# EAGLE design prototype2 (EAGLE 9.3.1)

## Sheet 1 of 5
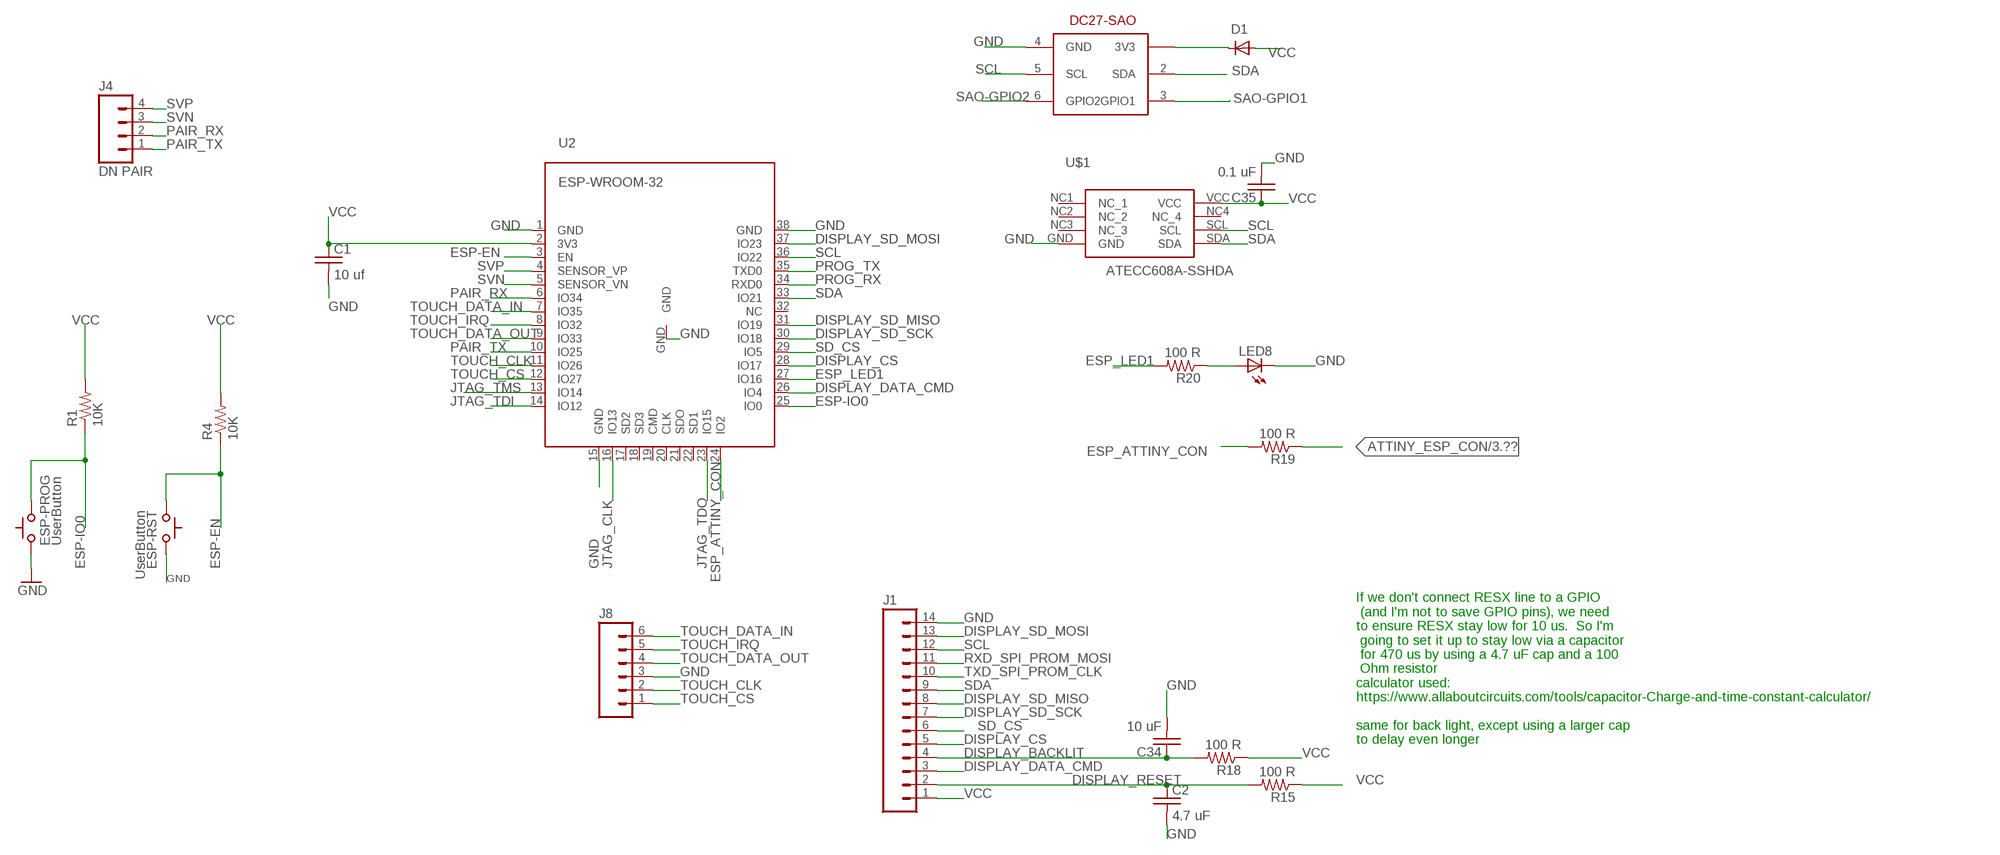
[diagram p0: schematic, sheet 1]

### Parts
C1  10 uf  C-USC0805  [C0805]
C2  4.7 uF  C-USC0805  [C0805]
C34  10 uF  C-USC0805  [C0805]
C35  0.1 uF  C-USC0805  [C0805]
D1  DIODESMA  [SMA-DIODE]
ESP-PROG  UserButton  SWITCH_TACTILETACTILE-2PIN-NARROW  [TACTILE-2PIN-NARROW]
ESP-RST  UserButton  SWITCH_TACTILETACTILE-2PIN-NARROW  [TACTILE-2PIN-NARROW]
J1  M14  [1X14]
J4  DN PAIR  M04PTH  [1X04]
J8  M06NO_SILK_YES_STOP  [1X06_NO_SILK_YES_STOP]
LED8  LED3MM  [LED3MM]
R1  10K  RESISTOR0805-RES  [0805]
R4  10K  RESISTOR0805-RES  [0805]
R15  100 R  RESISTOR0805-RES  [0805]
R18  100 R  RESISTOR0805-RES  [0805]
R19  100 R  RESISTOR0805-RES  [0805]
R20  100 R  RESISTOR0805-RES  [0805]
U2  ESP-WROOM-32  [ESP-WROOM-32]
U$1  ATECC608A-SSHDA  [8-SOIC]
U$4  DC-27-SAO  [3X2]

### Nets
ATTINY_ESP_CON: R19.1 ; also sheet 3
DISPLAY_BACKLIT: C34.1 J1.4 R18.2
DISPLAY_CS: J1.5 U2.28(IO17)
DISPLAY_DATA_CMD: J1.3 U2.26(IO4)
DISPLAY_RESET: C2.1 J1.2 R15.2
DISPLAY_SD_MISO: J1.8 U2.31(IO19)
DISPLAY_SD_MOSI: J1.13 U2.37(IO23)
DISPLAY_SD_SCK: J1.7 U2.30(IO18)
ESP-EN: ESP-RST.P$2(C) R4.1 U2.3(EN)
ESP-IO0: ESP-PROG.P$1(A) R1.1 U2.25(IO0)
ESP_ATTINY_CON: R19.2 U2.24(IO2)
ESP_LED1: R20.2 U2.27(IO16)
GND: C1.2 C2.2 C34.2 C35.2 ESP-PROG.P$2(C) ESP-RST.P$1(A) J1.14 J8.3 LED8.K(C) U2.1(GND) U2.15(GND) U2.38(GND) U2.GND U$1.GND U$4.4(GND) ; also sheet 2,3,4
JTAG_CLK: U2.16(IO13) ; also sheet 2
JTAG_TDI: U2.14(IO12) ; also sheet 2
JTAG_TDO: U2.23(IO15) ; also sheet 2
JTAG_TMS: U2.13(IO14) ; also sheet 2
N$1: D1.C U$4.1(3V3)
N$9: LED8.A R20.1
PAIR_RX: J4.2 U2.6(IO34)
PAIR_TX: J4.1 U2.10(IO25)
PROG_RX: U2.34(RXD0) ; also sheet 2
PROG_TX: U2.35(TXD0) ; also sheet 2
RXD_SPI_PROM_MOSI: J1.11 ; also sheet 2
SAO-GPIO1: U$4.3(GPIO1)
SAO-GPIO2: U$4.6(GPIO2)
SCL: J1.12 U2.36(IO22) U$1.SCL U$4.5(SCL)
SD_CS: J1.6 U2.29(IO5)
SDA: J1.9 U2.33(IO21) U$1.SDA U$4.2(SDA)
SVN: J4.3 U2.5(SENSOR_VN)
SVP: J4.4 U2.4(SENSOR_VP)
TOUCH_CLK: J8.2 U2.11(IO26)
TOUCH_CS: J8.1 U2.12(IO27)
TOUCH_DATA_IN: J8.6 U2.7(IO35)
TOUCH_DATA_OUT: J8.4 U2.9(IO33)
TOUCH_IRQ: J8.5 U2.8(IO32)
TXD_SPI_PROM_CLK: J1.10 ; also sheet 2
VCC: C1.1 C35.1 D1.A J1.1 R1.2 R4.2 R15.1 R18.1 U2.2(3V3) U$1.VCC ; also sheet 2,4
Unconnected: U2.17(SD2) U2.18(SD3) U2.19(CMD) U2.20(CLK) U2.21(SDO) U2.22(SD1) U2.32(NC) U$1.NC1(NC_1) U$1.NC2(NC_2) U$1.NC3(NC_3) U$1.NC4(NC_4)

### Notes on the sheet
- If we don't connect RESX line to a GPIO
   (and I'm not to save GPIO pins), we need 
  to ensure RESX stay low for 10 us.  So I'm
   going to set it up to stay low via a capacitor
   for 470 us by using a 4.7 uF cap and a 100
   Ohm resistor
  calculator used:
  https://www.allaboutcircuits.com/tools/capacitor-Charge-and-time-constant-calculator/
  
  same for back light, except using a larger cap 
  to delay even longer

## Sheet 2 of 5
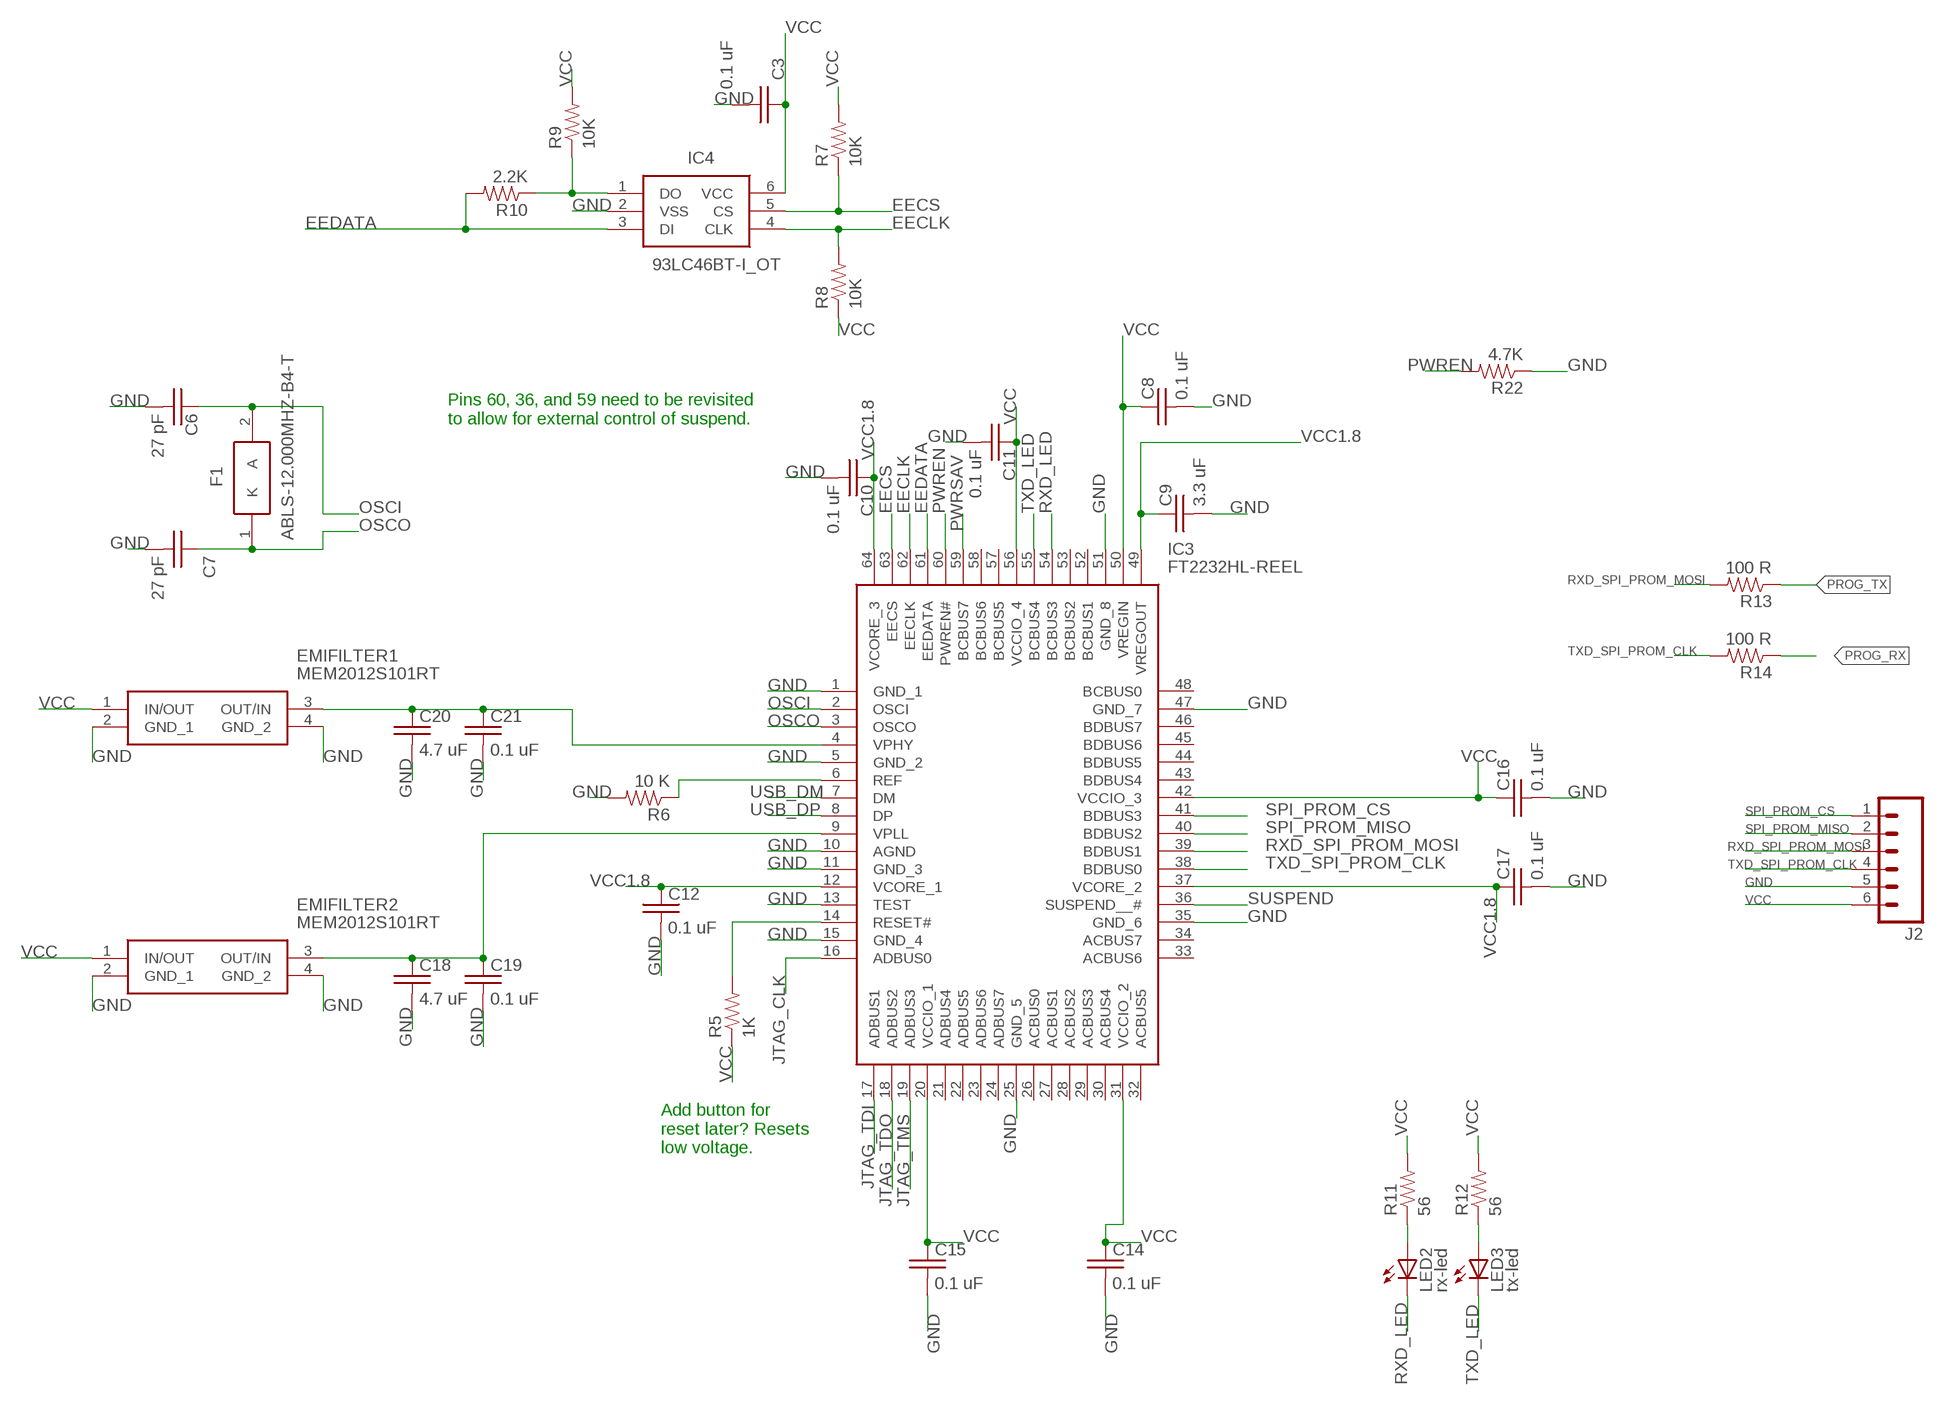
[diagram p1: schematic, sheet 2]

### Parts
C3  0.1 uF  C-USC0805  [C0805]
C6  27 pF  C-USC0805  [C0805]
C7  27 pF  C-USC0805  [C0805]
C8  0.1 uF  C-USC0805  [C0805]
C9  3.3 uF  C-USC0805  [C0805]
C10  0.1 uF  C-USC0805  [C0805]
C11  0.1 uF  C-USC0805  [C0805]
C12  0.1 uF  C-USC0805  [C0805]
C14  0.1 uF  C-USC0805  [C0805]
C15  0.1 uF  C-USC0805  [C0805]
C16  0.1 uF  C-USC0805  [C0805]
C17  0.1 uF  C-USC0805  [C0805]
C18  4.7 uF  C-USC0805  [C0805]
C19  0.1 uF  C-USC0805  [C0805]
C20  4.7 uF  C-USC0805  [C0805]
C21  0.1 uF  C-USC0805  [C0805]
EMIFILTER1  MEM2012S101RT  [MEM2012S101RT]
EMIFILTER2  MEM2012S101RT  [MEM2012S101RT]
F1  ABLS-12.000MHZ-B4-T  [HC/49US-(AT49)_1]
IC3  FT2232HL-REEL  [QFP50P1200X1200X160-64N]
IC4  93LC46BT-I_OT  [SOT95P270X145-6N]
J2  M06SILK_FEMALE_PTH  [1X06]
LED2  rx-led  LED3MM  [LED3MM]
LED3  tx-led  LED3MM  [LED3MM]
R5  1K  RESISTOR0805-RES  [0805]
R6  10 K  RESISTOR0805-RES  [0805]
R7  10K  RESISTOR0805-RES  [0805]
R8  10K  RESISTOR0805-RES  [0805]
R9  10K  RESISTOR0805-RES  [0805]
R10  2.2K  RESISTOR0805-RES  [0805]
R11  56  RESISTOR0805-RES  [0805]
R12  56  RESISTOR0805-RES  [0805]
R13  100 R  RESISTOR0805-RES  [0805]
R14  100 R  RESISTOR0805-RES  [0805]
R22  4.7K  RESISTOR0805-RES  [0805]

### Nets
EECLK: IC3.62(EECLK) IC4.4(CLK) R8.2
EECS: IC3.63(EECS) IC4.5(CS) R7.1
EEDATA: IC3.61(EEDATA) IC4.3(DI) R10.2
GND: C3.2 C6.2 C7.2 C8.2 C9.2 C10.2 C11.2 C12.2 C14.2 C15.2 C16.2 C17.2 C18.2 C19.2 C20.2 C21.2 EMIFILTER1.2(GND_1) EMIFILTER1.4(GND_2) EMIFILTER2.2(GND_1) EMIFILTER2.4(GND_2) IC3.1(GND_1) IC3.5(GND_2) IC3.10(AGND) IC3.11(GND_3) IC3.13(TEST) IC3.15(GND_4) IC3.25(GND_5) IC3.35(GND_6) IC3.47(GND_7) IC3.51(GND_8) IC4.2(VSS) J2.5 R6.2 R22.1 ; also sheet 1,3,4
JTAG_CLK: IC3.16(ADBUS0) ; also sheet 1
JTAG_TDI: IC3.17(ADBUS1) ; also sheet 1
JTAG_TDO: IC3.18(ADBUS2) ; also sheet 1
JTAG_TMS: IC3.19(ADBUS3) ; also sheet 1
N$6: IC3.14(RESET#) R5.2
N$7: IC3.6(REF) R6.1
N$8: IC4.1(DO) R9.1 R10.1
N$11: LED2.A R11.1
N$13: LED3.A R12.1
N$18: C18.1 C19.1 EMIFILTER2.3(OUT/IN) IC3.9(VPLL)
N$19: C20.1 C21.1 EMIFILTER1.3(OUT/IN) IC3.4(VPHY)
OSCI: C6.1 F1.2(A) IC3.2(OSCI)
OSCO: C7.1 F1.1(K) IC3.3(OSCO)
PROG_RX: R14.1 ; also sheet 1
PROG_TX: R13.1 ; also sheet 1
PWREN: IC3.60(PWREN#) R22.2
PWRSAV: IC3.59(BCBUS7)
RXD_LED: IC3.54(BCBUS3) LED2.K(C)
RXD_SPI_PROM_MOSI: IC3.39(BDBUS1) J2.3 R13.2 ; also sheet 1
SPI_PROM_CS: IC3.41(BDBUS3) J2.1
SPI_PROM_MISO: IC3.40(BDBUS2) J2.2
SUSPEND: IC3.36(SUSPEND__#)
TXD_LED: IC3.55(BCBUS4) LED3.K(C)
TXD_SPI_PROM_CLK: IC3.38(BDBUS0) J2.4 R14.2 ; also sheet 1
USB_DM: IC3.7(DM) ; also sheet 4
USB_DP: IC3.8(DP) ; also sheet 4
VCC: C3.1 C8.1 C11.1 C14.1 C15.1 C16.1 EMIFILTER1.1(IN/OUT) EMIFILTER2.1(IN/OUT) IC3.20(VCCIO_1) IC3.31(VCCIO_2) IC3.42(VCCIO_3) IC3.50(VREGIN) IC3.56(VCCIO_4) IC4.6(VCC) J2.6 R5.1 R7.2 R8.1 R9.2 R11.2 R12.2 ; also sheet 1,4
VCC1.8: C9.1 C10.1 C12.1 C17.1 IC3.12(VCORE_1) IC3.37(VCORE_2) IC3.49(VREGOUT) IC3.64(VCORE_3)
Unconnected: IC3.21(ADBUS4) IC3.22(ADBUS5) IC3.23(ADBUS6) IC3.24(ADBUS7) IC3.26(ACBUS0) IC3.27(ACBUS1) IC3.28(ACBUS2) IC3.29(ACBUS3) IC3.30(ACBUS4) IC3.32(ACBUS5) IC3.33(ACBUS6) IC3.34(ACBUS7) IC3.43(BDBUS4) IC3.44(BDBUS5) IC3.45(BDBUS6) IC3.46(BDBUS7) IC3.48(BCBUS0) IC3.52(BCBUS1) IC3.53(BCBUS2) IC3.57(BCBUS5) IC3.58(BCBUS6)

### Notes on the sheet
- Pins 60, 36, and 59 need to be revisited 
  to allow for external control of suspend.
- Add button for 
  reset later? Resets
  low voltage.

## Sheet 3 of 5
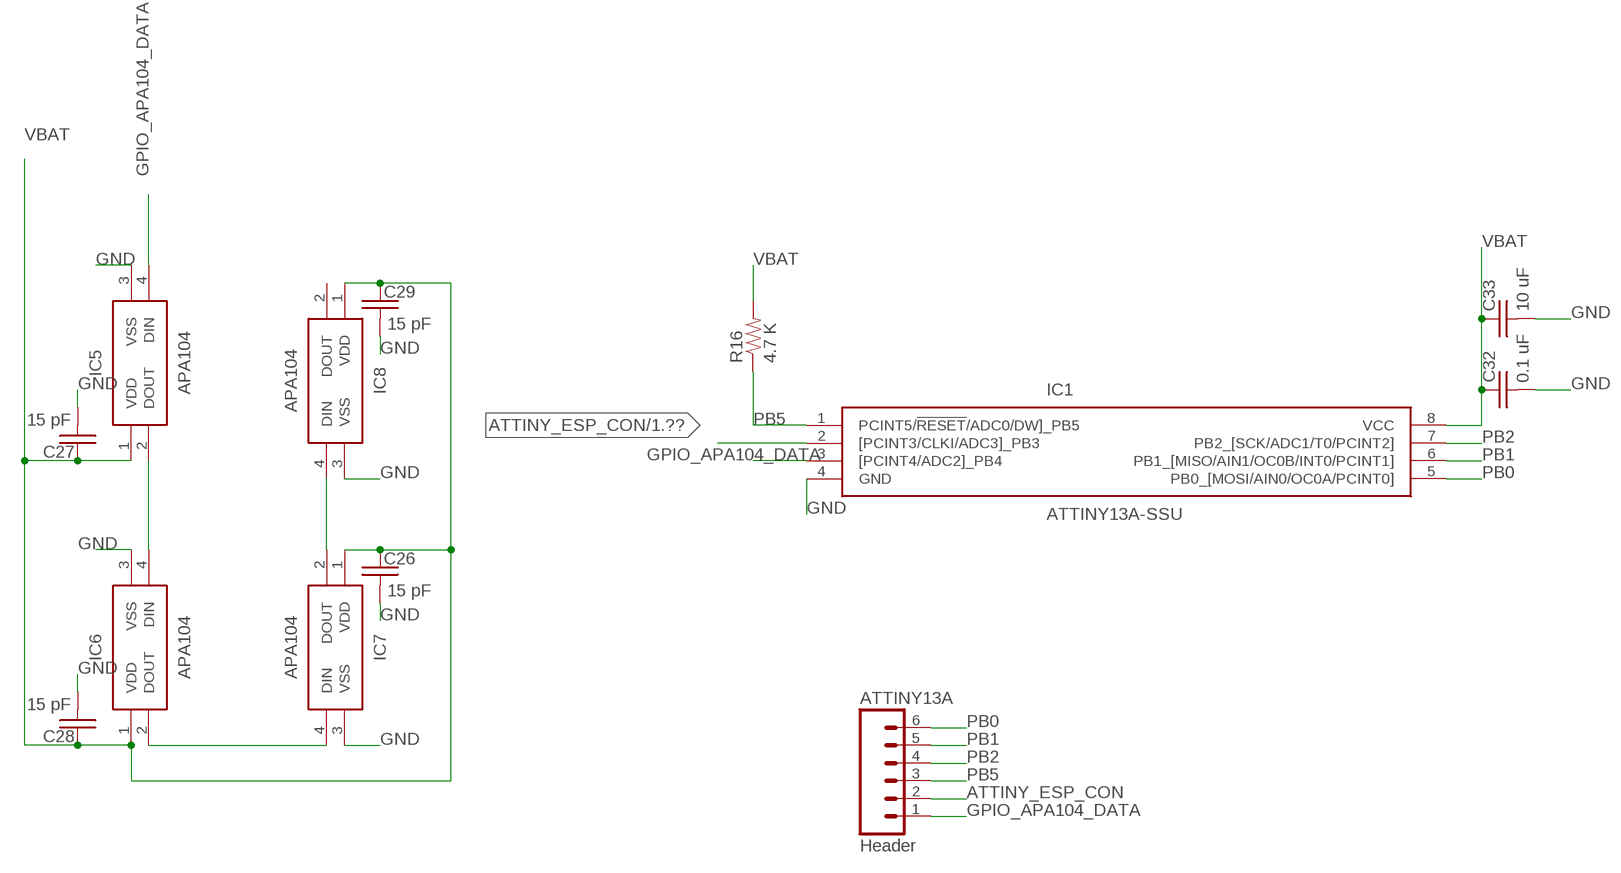
[diagram p2: schematic, sheet 3]

### Parts
ATTINY13A  Header  M06SILK_FEMALE_PTH  [1X06]
C26  15 pF  C-USC0805  [C0805]
C27  15 pF  C-USC0805  [C0805]
C28  15 pF  C-USC0805  [C0805]
C29  15 pF  C-USC0805  [C0805]
C32  0.1 uF  C-USC0805  [C0805]
C33  10 uF  C-USC0805  [C0805]
IC1  ATTINY13A-SSU  [SOIC127P600X175-8N]
IC5  APA104  [APA104]
IC6  APA104  [APA104]
IC7  APA104  [APA104]
IC8  APA104  [APA104]
R16  4.7 K  RESISTOR0805-RES  [0805]

### Nets
ATTINY_ESP_CON: ATTINY13A.2 IC1.2([PCINT3/CLKI/ADC3]_PB3) ; also sheet 1
GND: C26.2 C27.2 C28.2 C29.2 C32.2 C33.2 IC1.4(GND) IC5.3(VSS) IC6.3(VSS) IC7.3(VSS) IC8.3(VSS) ; also sheet 1,2,4
GPIO_APA104_DATA: ATTINY13A.1 IC1.3([PCINT4/ADC2]_PB4) IC5.4(DIN)
N$4: IC5.2(DOUT) IC6.4(DIN)
N$12: IC6.2(DOUT) IC7.4(DIN)
N$22: IC7.2(DOUT) IC8.4(DIN)
PB0: ATTINY13A.6 IC1.5(PB0_[MOSI/AIN0/OC0A/PCINT0])
PB1: ATTINY13A.5 IC1.6(PB1_[MISO/AIN1/OC0B/INT0/PCINT1])
PB2: ATTINY13A.4 IC1.7(PB2_[SCK/ADC1/T0/PCINT2])
PB5: ATTINY13A.3 IC1.1(PCINT5/!RESET!/ADC0/DW]_PB5) R16.1
VBAT [5v]: C26.1 C27.1 C28.1 C29.1 C32.1 C33.1 IC1.8(VCC) IC5.1(VDD) IC6.1(VDD) IC7.1(VDD) IC8.1(VDD) R16.2 ; also sheet 4
Unconnected: IC8.2(DOUT)

## Sheet 4 of 5
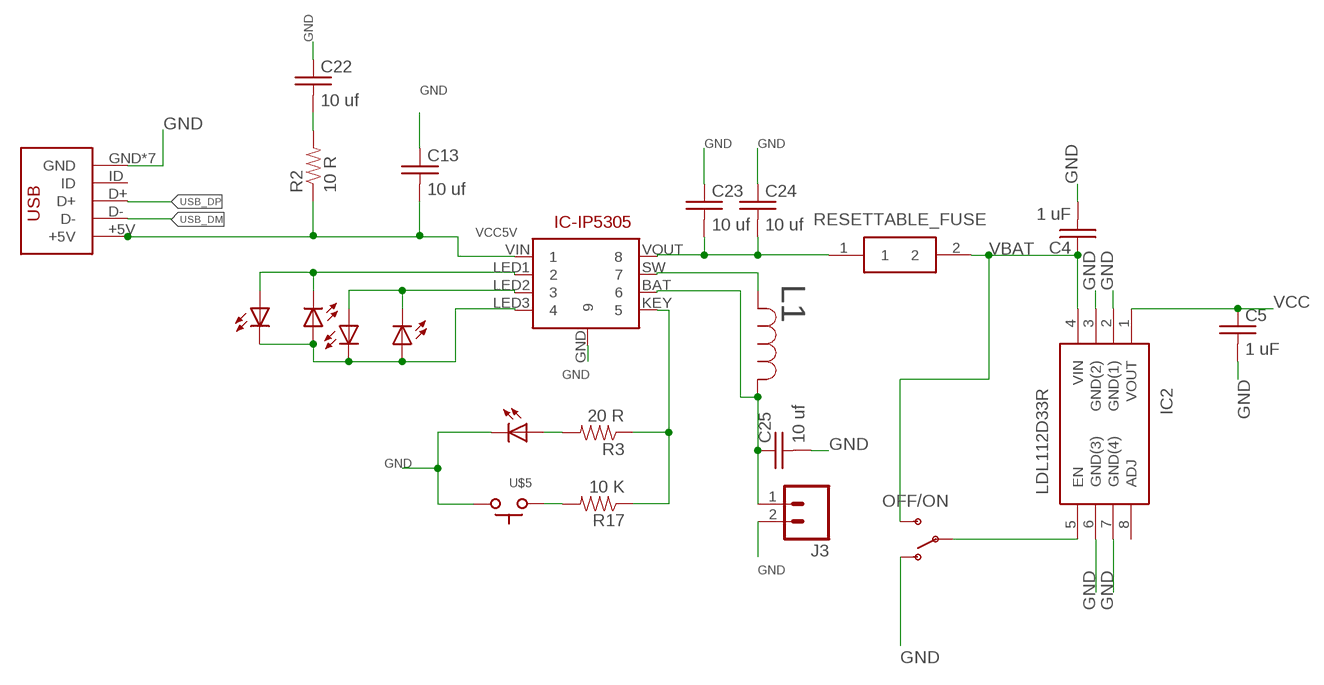
[diagram p3: schematic, sheet 4]

### Parts
C4  1 uF  C-USC0805  [C0805]
C5  1 uF  C-USC0805  [C0805]
C13  10 uf  C-USC0805  [C0805]
C22  10 uf  C-USC0805  [C0805]
C23  10 uf  C-USC0805  [C0805]
C24  10 uf  C-USC0805  [C0805]
C25  10 uf  C-USC0805  [C0805]
IC2  LDL112D33R  [SOIC127P600X175-8N]
IC-IP5305  IP5305ESOP8  [SOIC127P600X165-8]
J3  M02PTH  [1X02]
L1  NRS4018T2R2MDGJ  [IND_TAIYO_NRS4018]
LED1  LED3MM  [LED3MM]
LED4  LED3MM  [LED3MM]
LED5  LED3MM  [LED3MM]
LED6  LED3MM  [LED3MM]
LED7  LED3MM  [LED3MM]
OFF/ON  SWITCH-SPSTPTH  [SWITCH-SPDT]
R2  10 R  RESISTOR0805-RES  [0805]
R3  20 R  RESISTOR0805-RES  [0805]
R17  10 K  RESISTOR0805-RES  [0805]
RESETTABLE_FUSE  0ZCJ0050FF2G  [FUSC3216X55N]
U$2  DX4R005JJ2DX4R005JJ2  [DX4R005JJ2]
U$5  SWITCH_TACTILETACTILE-2PIN-NARROW  [TACTILE-2PIN-NARROW]

### Nets
GND: C4.2 C5.2 C13.1 C22.1 C23.1 C24.1 C25.2 IC2.2(GND(1)) IC2.3(GND(2)) IC2.6(GND(3)) IC2.7(GND(4)) IC-IP5305.GND J3.2 LED7.K(C) OFF/ON.1(O) U$2.GND U$2.P$6(GND) U$2.P$7(GND) U$2.P$8(GND) U$2.P$9(GND) U$2.P$10(GND) U$2.P$11(GND) U$5.P$1(A) ; also sheet 1,2,3
N$2: IC2.5(EN) OFF/ON.2(P)
N$5: IC-IP5305.LED1 LED1.A LED4.K(C)
N$10: C23.2 C24.2 IC-IP5305.VOUT RESETTABLE_FUSE.1
N$14: IC-IP5305.LED2 LED5.A LED6.K(C)
N$15: IC-IP5305.LED3 LED1.K(C) LED4.A LED5.K(C) LED6.A
N$16: C22.2 R2.2
N$17: IC-IP5305.SW L1.2
N$20: C25.1 IC-IP5305.BAT J3.1 L1.1
N$21: IC-IP5305.KEY R3.1 R17.1
N$24: LED7.A R3.2
N$25: R17.2 U$5.P$2(C)
USB_DM: U$2.D- ; also sheet 2
USB_DP: U$2.D+ ; also sheet 2
VBAT [5v]: C4.1 IC2.4(VIN) OFF/ON.3(S) RESETTABLE_FUSE.2 ; also sheet 3
VCC: C5.1 IC2.1(VOUT) ; also sheet 1,2
VCC5V [5v]: C13.2 IC-IP5305.VIN R2.1 U$2.+5V
Unconnected: IC2.8(ADJ) U$2.ID

## Sheet 5 of 5
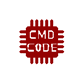
[diagram p4: schematic, sheet 5]

### Parts
U$3  CMD_C0DE_LOGOCMD_CODE_LOGO_TOP_COPPER  [CMD_C0DE_LOGO_TOP_COPPER]

## Library data of the parts
ATTINY13A J2 = connector:M06: Header 6 Standard 6-pin 0.1" header. Use with straight break away headers (SKU : PRT-00116), right angle break away headers (PRT-00553), swiss pins (PRT-00743), machine pins (PRT-00117), and female headers (PRT-00115). Molex polarized connector foot print use with SKU : PRT-08094 with associated crimp pins and housings. NOTES ON THE VARIANTS LOCK and LOCK_LONGPADS... This footprint was designed to help hold the alignment of a through-hole component (i.e. 6-pin header) while soldering it into place. You may notice that each hole has been shifted either up or down by 0.005 of an inch from it's more standard position (which is a perfectly straight line). This slight alteration caused the pins (the squares in the middle) to touch the edges of the holes. Because they are alternating, it causes a "brace" to hold the component in place. 0.005 has proven to be the perfect amount of "off-center" position when using our standard breakaway headers. Although looks a little odd when you look at the bare footprint, once you have a header in there, the alteration is very hard to notice. Also,if you push a header all the way into place, it is covered up entirely on the bottom side. This idea of altering the position of holes to aid alignment will be further integrated into the Sparkfun Library for other footprints. It can help hold any component with 3 or more connection pins.; PROD_ID: CONN-08437
C1-C29 C32-C35 = passives:C-US: CAPACITOR, American symbol
D1 = passives:DIODE: Diode These are standard reverse protection diodes and small signal diodes. SMA package can handle up to about 1A. SOD-323 can handle about 200mA. What the SOD-323 package when ordering, there are some mfgs out there that are 5-pin packages.
EMIFILTER1 EMIFILTER2 = passives:MEM2012S101RT: EMI Filter Circuits Source: Datasheet <https://componentsearchengine.com/Datasheets/1/MEM2012S101RT.pdf>; DESCRIPTION: EMI Filter Circuits; HEIGHT: 1mm; MANUFACTURER_NAME: TDK; MANUFACTURER_PART_NUMBER: MEM2012S101RT; MOUSER_PART_NUMBER: N/A
ESP-PROG ESP-RST = dc-26:SWITCH_TACTILE
F1 = crystals-timing:ABLS-12.000MHZ-B4-T: ABRACON - ABLS-12.000MHZ-B4-T - CRYSTAL, 12MHZ, 18PF, HC-49US Source: Datasheet <https://componentsearchengine.com/Datasheets/2/ABLS-12.000MHZ-B4-T.pdf>; DESCRIPTION: ABRACON - ABLS-12.000MHZ-B4-T - CRYSTAL, 12MHZ, 18PF, HC-49US; HEIGHT: mm; MANUFACTURER_NAME: ABRACON; MANUFACTURER_PART_NUMBER: ABLS-12.000MHZ-B4-T; MOUSER_PART_NUMBER: 815-ABLS-12.0M-T; MOUSER_PRICE-STOCK: https://www.mouser.com/Search/Refine.aspx?Keyword=815-ABLS-12.0M-T; RS_PART_NUMBER: 1710207; RS_PRICE-STOCK: http://uk.rs-online.com/web/p/products/1710207
IC1 = ICs:ATTINY13A-SSU: ATTINY13A-SSU, 8 bit AVR Microcontroller 20MHz 1, 64kB, B Flash, 64B RAM, SPI 8-Pin SOIC Source: Datasheet <http://www.mouser.com/datasheet/2/268/doc8126-1315482.pdf>; DESCRIPTION: ATTINY13A-SSU, 8 bit AVR Microcontroller 20MHz 1, 64kB, B Flash, 64B RAM, SPI 8-Pin SOIC; HEIGHT: 1.75mm; MANUFACTURER_NAME: Microchip; MANUFACTURER_PART_NUMBER: ATTINY13A-SSU; MOUSER_PART_NUMBER: 556-ATTINY13A-SSU
IC2 = voltage-regulator:LDL112D33R: LDO Voltage Regulators 1.2 A low quiescent current LDO with reverse current protection Source: Datasheet <https://www.arrow.com/en/products/ldl112d33r/stmicroelectronics>; ARROW_PART_NUMBER: LDL112D33R; ARROW_PRICE/STOCK: https://www.arrow.com/en/products/ldl112d33r/stmicroelectronics; DESCRIPTION: LDO Voltage Regulators 1.2 A low quiescent current LDO with reverse current protection; HEIGHT: 1.75mm; MANUFACTURER_NAME: STMicroelectronics; MANUFACTURER_PART_NUMBER: LDL112D33R
IC3 = ICs:FT2232HL-REEL: FTDI Chip FT2232HL-REEL, USB Controller, 4-channel, 480MBps, USB 2.0, 64-Pin LQFP Source: Datasheet <https://componentsearchengine.com/Datasheets/1/FT2232HL-REEL.pdf>; DESCRIPTION: FTDI Chip FT2232HL-REEL, USB Controller, 4-channel, 480MBps, USB 2.0, 64-Pin LQFP; HEIGHT: 1.6mm; MANUFACTURER_NAME: FTDI Chip; MANUFACTURER_PART_NUMBER: FT2232HL-REEL; MOUSER_PART_NUMBER: 895-FT2232HL
IC4 = eeprom:93LC46BT-I_OT: 1K,64 X 16 Serial EE,SOT23 Source: Datasheet <https://componentsearchengine.com/Datasheets/1/93LC46BT-I_OT.pdf>; DESCRIPTION: 1K,64 X 16 Serial EE,SOT23; HEIGHT: 1.45mm; MANUFACTURER_NAME: Microchip; MANUFACTURER_PART_NUMBER: 93LC46BT-I/OT; MOUSER_PART_NUMBER: 579-93LC46BT-I/OT
IC5-IC8 = leds:APA104: APA104 LED CHIP Source: Datasheet <http://www.ledlightinghut.com/files/APA104%20Datasheet.pdf>; DESCRIPTION: APA104 LED Chip; HEIGHT: mm; MANUFACTURER_NAME: Worldsemi; MANUFACTURER_PART_NUMBER: APA104; SUPPLIER_NAME: RS
IC-IP5305 = charging-ic:IP5305: IP5305
J1 = connector:M14: Header 14 Standard 14-pin 0.1" header. Use with straight break away headers (SKU : PRT-00116), right angle break away headers (PRT-00553), swiss pins (PRT-00743), machine pins (PRT-00117), and female headers (PRT-00115).
J3 = connector:M02: Standard 2-pin 0.1" header. Use with - straight break away headers ( PRT-00116) - right angle break away headers (PRT-00553) - swiss pins (PRT-00743) - machine pins (PRT-00117) - female headers (PRT-00115) Molex polarized connector foot print use with: PRT-08233 with associated crimp pins and housings. 2.54_SCREWTERM for use with PRT-10571. 3.5mm Screw Terminal footprints for PRT-08084 5mm Screw Terminal footprints for use with PRT-08432
J4 = connector:M04: Header 4 Standard 4-pin 0.1" header. Use with straight break away headers (SKU : PRT-00116), right angle break away headers (PRT-00553), swiss pins (PRT-00743), machine pins (PRT-00117), and female headers (PRT-00115). Molex polarized connector foot print use with SKU : PRT-08231 with associated crimp pins and housings. 1MM SMD Version SKU: PRT-10208; PROD_ID: CONN-09696
J8 = connector:M06: Header 6 Standard 6-pin 0.1" header. Use with straight break away headers (SKU : PRT-00116), right angle break away headers (PRT-00553), swiss pins (PRT-00743), machine pins (PRT-00117), and female headers (PRT-00115). Molex polarized connector foot print use with SKU : PRT-08094 with associated crimp pins and housings. NOTES ON THE VARIANTS LOCK and LOCK_LONGPADS... This footprint was designed to help hold the alignment of a through-hole component (i.e. 6-pin header) while soldering it into place. You may notice that each hole has been shifted either up or down by 0.005 of an inch from it's more standard position (which is a perfectly straight line). This slight alteration caused the pins (the squares in the middle) to touch the edges of the holes. Because they are alternating, it causes a "brace" to hold the component in place. 0.005 has proven to be the perfect amount of "off-center" position when using our standard breakaway headers. Although looks a little odd when you look at the bare footprint, once you have a header in there, the alteration is very hard to notice. Also,if you push a header all the way into place, it is covered up entirely on the bottom side. This idea of altering the position of holes to aid alignment will be further integrated into the Sparkfun Library for other footprints. It can help hold any component with 3 or more connection pins.
L1 = passives:NRS4018T2R2MDGJ: Inductor: CD43; MANUFACTURER_PART_NUMBER: NRS4018T2R2MDGJ; VENDOR: TAIYO YUDEN
LED1-LED8 = leds:LED: LEDs Standard schematic elements and footprints for 5mm, 3mm, 1206, and 0603 sized LEDs. 5mm - Spark Fun Electronics SKU : COM-00529 (and others)
OFF/ON = switches:SWITCH-SPST: SPST Switch Simple slide switch.
R1 R4 R15 R18-R20 = dc-26:RESISTOR: Resistor Basic schematic elements and footprints for 0603, 1206, and PTH resistors.
R2 R3 R5-R14 R16 R17 R22 = passives:RESISTOR: Resistor Basic schematic elements and footprints for 0603, 1206, and PTH resistors.
RESETTABLE_FUSE = passives:0ZCJ0050FF2G: Resettable Fuses - PPTC <https://componentsearchengine.com/Images/9/0ZCJ0050FF2G.jpg> Source: Datasheet <https://www.belfuse.com/resources/CircuitProtection/datasheets/0ZCJ Nov2016.pdf>; DESCRIPTION: Resettable Fuses - PPTC; HEIGHT: 0.55mm; MANUFACTURER_NAME: Bel-Stewart; MANUFACTURER_PART_NUMBER: 0ZCJ0050FF2G; SUPPLIER_NAME: RS
U2 = ICs:ESP-WROOM-32
U$1 = ICs:ATECC608A-SSHDA
U$2 = connector:DX4R005JJ2
U$3 = logos:CMD_C0DE_LOGO
U$4 = defcon:DC-27-SAO: DC27SAO device
U$5 = switches:SWITCH_TACTILE

## Net classes
0 default: width 0.178 mm, drill 0.8 mm, clearance 0.178 mm
1 min: width 0.152 mm, drill 0.8 mm, clearance 0.152 mm
2 5v: width 0.254 mm, drill 0.8 mm, clearance 0.178 mm

## Board
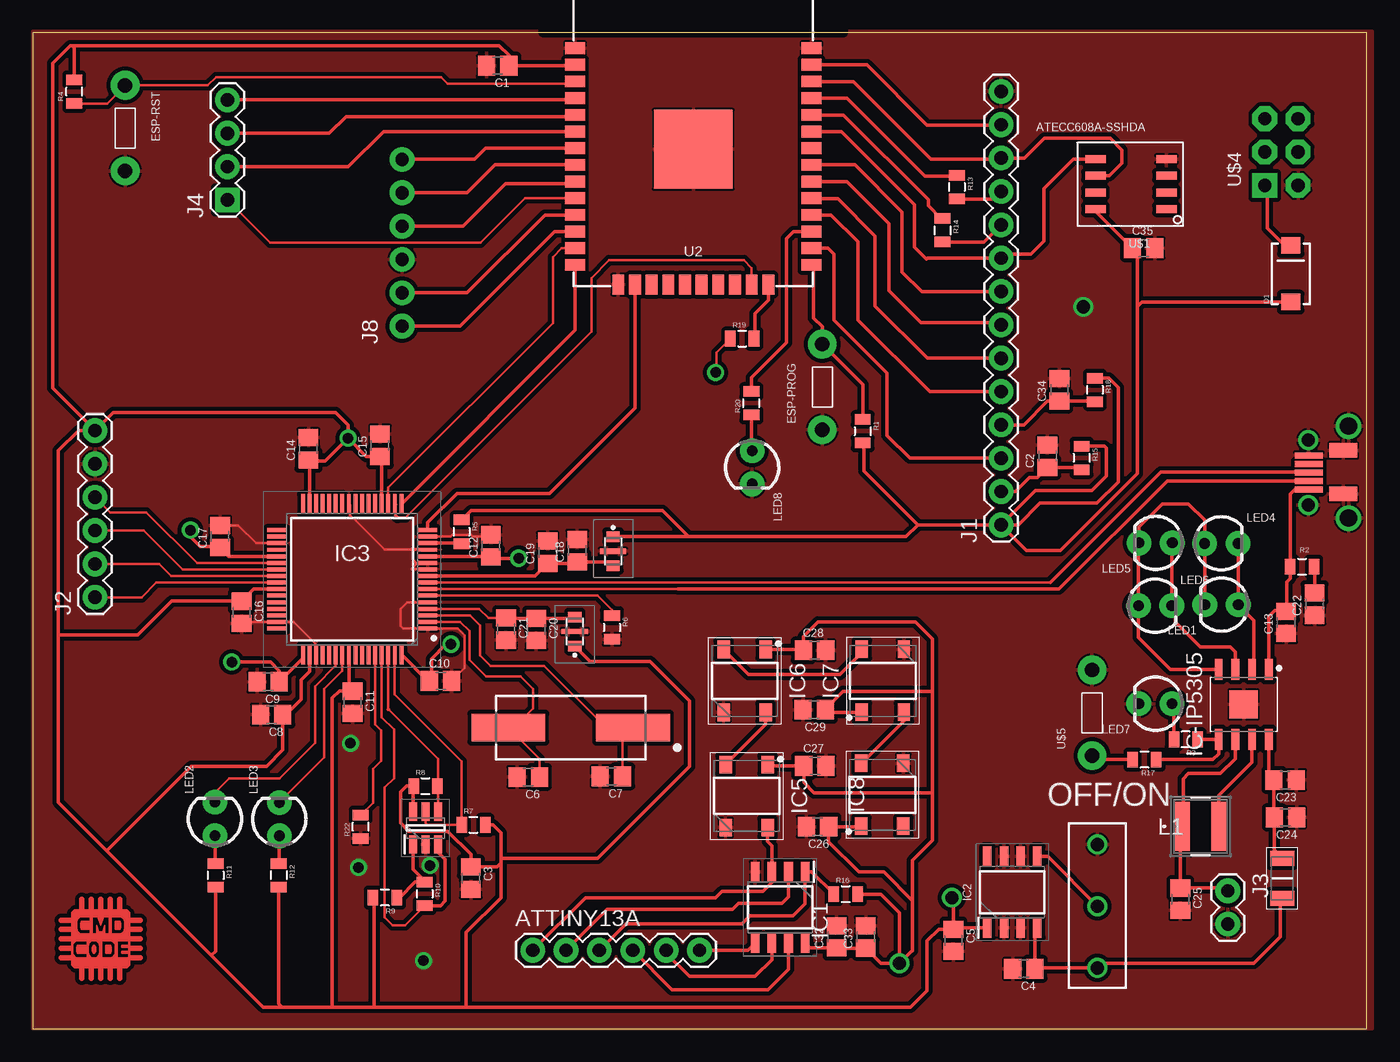
[diagram p5: board, top side]
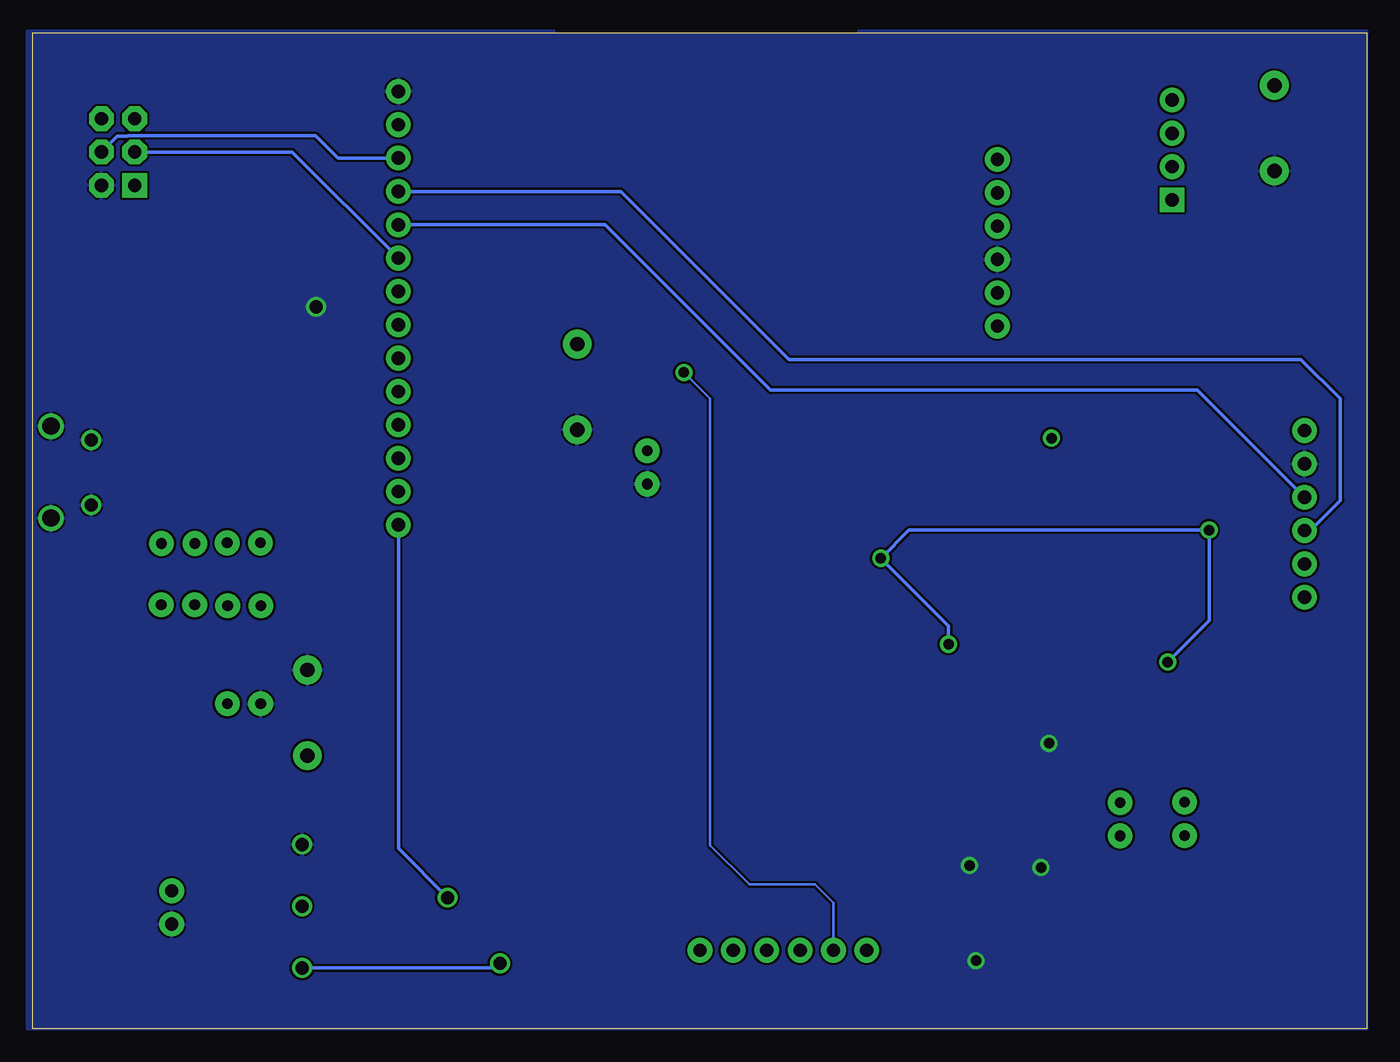
[diagram p6: board, bottom side, seen from below]

Size 101.58 x 75.87 mm. Coordinates in mm from the lower left corner, seen from the top.
Outline: 0,0 101.58,0 101.58,75.87 0,75.87 0,0
Copper layers (1*16): Top 0.035mm / dielectric 1.5mm / Bottom 0.035mm
Design rules "OthermillDRC_30_deg_v2": minimum track width 6mil, minimum drill 0.8mm, track to track 6mil, track to pad 6mil, pad to pad 6mil, via to via 6mil, smd to smd 0mil, copper to edge 0mil, drill to drill 6mil, minimum pad ring 10mil, minimum via ring 10mil, stop-mask expansion 1mil, vias tented up to drill 30mil, thermal gap 6mil

### Footprints (pad centres in the part's own frame; a part is rotated, then mirrored left to right if it is on the bottom)
1X06 = drill 1.016 pad 1.88: 1 0,0; 2 2.54,0; 3 5.08,0; 4 7.62,0; 5 10.16,0; 6 12.7,0
C0805 = smd 1.3 x 1.5: 1 -0.85,0; 2 0.85,0
SMA-DIODE = smd 1.27 x 1.47: A -2.15,0; C 2.15,0
MEM2012S101RT = smd 0.8 x 1: 1 -1.1,0; 3 1.1,0 | smd 0.4 x 1: 2 0,-0.5; 4 0,0.5
TACTILE-2PIN-NARROW = drill 1.1 pad 2.184: P$1 3.264,0; P$2 -3.264,0
HC/49US-(AT49)_1 = smd 5.6 x 2.1: 1 -4.75,0; 2 4.75,0
SOIC127P600X175-8N = smd 1.525 x 0.65: 1 -2.712,1.905; 2 -2.712,0.635; 3 -2.712,-0.635; 4 -2.712,-1.905; 5 2.712,-1.905; 6 2.712,-0.635; 7 2.712,0.635; 8 2.712,1.905
QFP50P1200X1200X160-64N = smd 1.475 x 0.3: 1 -5.738,3.75; 2 -5.738,3.25; 3 -5.738,2.75; 4 -5.738,2.25; 5 -5.738,1.75; 6 -5.738,1.25; 7 -5.738,0.75; 8 -5.738,0.25; 9 -5.738,-0.25; 10 -5.738,-0.75; 11 -5.738,-1.25; 12 -5.738,-1.75; 13 -5.738,-2.25; 14 -5.738,-2.75; 15 -5.738,-3.25; 16 -5.738,-3.75; 33 5.738,-3.75; 34 5.738,-3.25; 35 5.738,-2.75; 36 5.738,-2.25; 37 5.738,-1.75; 38 5.738,-1.25; 39 5.738,-0.75; 40 5.738,-0.25; 41 5.738,0.25; 42 5.738,0.75; 43 5.738,1.25; 44 5.738,1.75; 45 5.738,2.25; 46 5.738,2.75; 47 5.738,3.25; 48 5.738,3.75 | smd 0.3 x 1.475: 17 -3.75,-5.738; 18 -3.25,-5.738; 19 -2.75,-5.738; 20 -2.25,-5.738; 21 -1.75,-5.738; 22 -1.25,-5.738; 23 -0.75,-5.738; 24 -0.25,-5.738; 25 0.25,-5.738; 26 0.75,-5.738; 27 1.25,-5.738; 28 1.75,-5.738; 29 2.25,-5.738; 30 2.75,-5.738; 31 3.25,-5.738; 32 3.75,-5.738; 49 3.75,5.738; 50 3.25,5.738; 51 2.75,5.738; 52 2.25,5.738; 53 1.75,5.738; 54 1.25,5.738; 55 0.75,5.738; 56 0.25,5.738; 57 -0.25,5.738; 58 -0.75,5.738; 59 -1.25,5.738; 60 -1.75,5.738; 61 -2.25,5.738; 62 -2.75,5.738; 63 -3.25,5.738; 64 -3.75,5.738
SOT95P270X145-6N = smd 1.4 x 0.6: 1 -1.25,0.95; 2 -1.25,0; 3 -1.25,-0.95; 4 1.25,-0.95; 5 1.25,0; 6 1.25,0.95
APA104 = smd 1.35 x 0.95: 1 -2.4,1.6; 2 -2.4,-1.6; 3 2.4,-1.6; 4 2.4,1.6
SOIC127P600X165-8 = smd 1.609 x 0.594: BAT 2.653,-0.635; KEY 2.653,-1.905; LED1 -2.653,0.635; LED2 -2.653,-0.635; LED3 -2.653,-1.905; SW 2.653,0.635; VIN -2.653,1.905; VOUT 2.653,1.905 | smd 2.15 x 2.15: GND 0,0
1X14 = drill 1.016 pad 1.88: 1 0,0; 2 2.54,0; 3 5.08,0; 4 7.62,0; 5 10.16,0; 6 12.7,0; 7 15.24,0; 8 17.78,0; 9 20.32,0; 10 22.86,0; 11 25.4,0; 12 27.94,0; 13 30.48,0; 14 33.02,0
1X02 = drill 1.016 pad 1.88: 1 0,0; 2 2.54,0
1X04 = drill 1.016 pad 1.88 square: 1 0,0 | drill 1.016 pad 1.88: 2 2.54,0; 3 5.08,0; 4 7.62,0
1X06_NO_SILK_YES_STOP = drill 1.016 pad 1.88: 1 0,0; 2 2.54,0; 3 5.08,0; 4 7.62,0; 5 10.16,0; 6 12.7,0
IND_TAIYO_NRS4018 = smd 1.194 x 3.708: 1 -1.397,0; 2 1.397,0
LED3MM = drill 0.813 pad 1.88: A -1.27,0; K 1.27,0
SWITCH-SPDT = drill 1.016 pad 1.27: 1 0,4.7; 3 0,-4.7 | drill 1 pad 1.27: 2 0,0
0805 = smd 0.8 x 1.2: 1 -0.9,0; 2 0.9,0
FUSC3216X55N = smd 1.17 x 1.82: 1 -1.52,0; 2 1.52,0
ESP-WROOM-32 = smd 0.9 x 1.5: 1 7.7,9; 2 6.43,9; 3 5.16,9; 4 3.89,9; 5 2.62,9; 6 1.35,9; 7 0.08,9; 8 -1.19,9; 9 -2.46,9; 10 -3.73,9; 11 -5,9; 12 -6.27,9; 13 -7.54,9; 14 -8.81,9; 25 -8.81,-9; 26 -7.54,-9; 27 -6.27,-9; 28 -5,-9; 29 -3.73,-9; 30 -2.46,-9; 31 -1.19,-9; 32 0.08,-9; 33 1.35,-9; 34 2.62,-9; 35 3.89,-9; 36 5.16,-9; 37 6.43,-9; 38 7.7,-9 | smd 1.5 x 0.9: 15 -10.3,5.715; 16 -10.3,4.445; 17 -10.3,3.175; 18 -10.3,1.905; 19 -10.3,0.635; 20 -10.3,-0.635; 21 -10.3,-1.905; 22 -10.3,-3.175; 23 -10.3,-4.445; 24 -10.3,-5.715 | smd 6 x 6: GND 0,0
8-SOIC = smd 0.6 x 1.55: GND 3.81,0; NC1 0,0; NC2 1.27,0; NC3 2.54,0; NC4 1.27,5.4; SCL 2.54,5.4; SDA 3.81,5.4; VCC 0,5.4
DX4R005JJ2 = smd 2.1 x 0.45: +5V 0.72,-1.32; D+ 0.72,-0.02; D- 0.72,-0.67; GND 0.72,1.28; ID 0.72,0.63 | smd 2.1 x 1.1: P$6 3.35,1.65; P$8 3.35,-1.65 | drill 1: P$7 0.675,2.45; P$9 0.675,-2.5 | drill 1.3: P$10 3.75,-3.5; P$11 3.75,3.5
3X2 = drill 1.016 pad 1.88 square: 1 -2.54,1.27 | drill 1.016 pad 1.88 octagon: 2 0,1.27; 3 2.54,1.27; 4 -2.54,-1.27; 5 0,-1.27; 6 2.54,-1.27

### Placement (x,y rotation side)
ATTINY13A  38.07,5.99 0 top
C1  35.4,73.37 180 top
C2  77.27,43.62 90 top
C3  33.36,11.49 270 top
C4  75.47,4.59 180 top
C5  70.11,6.75 270 top
C6  37.73,19.19 180 top
C7  44.06,19.24 180 top
C8  18.19,23.94 180 top
C9  17.92,26.44 180 top
C10  31.05,26.51 0 top
C11  24.36,24.88 270 top
C12  34.89,36.79 90 top
C13  95.44,30.96 90 top
C14  20.99,44.18 90 top
C15  26.44,44.45 90 top
C16  15.91,31.73 270 top
C17  14.26,37.51 90 top
C18  41.46,36.43 90 top
C19  39.21,36.3 90 top
C20  38.34,30.43 270 top
C21  36.04,30.46 270 top
C22  97.61,32.36 90 top
C23  95.37,18.96 180 top
C24  95.4,16.11 180 top
C25  87.39,9.88 270 top
C26  59.76,15.41 180 top
C27  59.56,20.04 0 top
C28  59.53,28.84 0 top
C29  59.5,24.31 180 top
C32  61.21,7.02 90 top
C33  63.43,7.01 90 top
C34  78.18,48.68 90 top
C35  84.6,59.47 0 top
D1  95.8,57.52 90 top
EMIFILTER1  41.27,30.27 90 top
EMIFILTER2  44.19,36.39 270 top
ESP-PROG  60.12,48.9 90 top
ESP-RST  7.03,68.61 270 top
F1  40.96,22.95 180 top
IC1  56.91,9.26 270 top
IC2  74.59,10.42 90 top
IC3  24.32,34.25 180 top
IC4  29.9,15.31 90 top
IC5  54.36,17.74 270 top
IC6  54.21,26.51 270 top
IC7  64.74,26.52 90 top
IC8  64.7,17.84 90 top
IC-IP5305  92.21,24.72 270 top
J1  73.74,38.39 90 top
J2  4.74,32.88 90 top
J3  91.01,10.52 270 top
J4  14.82,63.14 90 top
J8  28.12,53.53 90 top
L1  88.93,15.43 0 top
LED1  90.53,32.32 180 top
LED2  13.87,16 90 top
LED3  18.77,15.98 90 top
LED4  90.51,36.98 0 top
LED5  85.51,37.02 180 top
LED6  85.47,32.23 0 top
LED7  85.5,24.77 180 top
LED8  54.78,42.77 270 top
OFF/ON  81.07,9.35 0 top
R1  63.2,45.53 270 top
R2  96.66,35.2 0 top
R3  87.8,22.05 180 top
R4  3.15,71.39 90 top
R5  32.65,37.87 270 top
R6  44.1,30.58 270 top
R7  33.56,15.55 0 top
R8  29.9,18.5 0 top
R9  26.81,10 180 top
R10  29.83,10.29 270 top
R11  13.93,11.7 270 top
R12  18.73,11.71 270 top
R13  70.38,64.12 270 top
R14  69.28,60.83 270 top
R15  79.88,43.49 270 top
R16  61.9,10.28 0 top
R17  84.66,20.52 180 top
R18  80.88,48.67 270 top
R19  54.02,52.58 0 top
R20  54.72,47.66 90 top
R22  24.97,15.4 90 top
RESETTABLE_FUSE  95.14,11.47 270 top
U2  50.3,67 90 top
U$1  86.33,62.44 90 top
U$2  96.45,42.41 0 top
U$3  5.17,7.18 0 top
U$4  95.09,66.79 90 top
U$5  80.67,24.08 90 top

### Tracks (layer width: path | path; a pad name or v marks a point on that pad's centre or on a via)
ATTINY_ESP_CON  (via drill 0.8)
  Top 0.178: v52,50 52.05,50.05 52.05,51.5 R19.1
  Top 0.254: ATTINY13A.2 43.72,9.1 53.3,9.1 53.75,9.55 57.05,9.55 57.55,10.04 IC1.2
  Bottom 0.178: ATTINY13A.2 40.61,9.61 42,11 47,11 50,14 50,48 v52,50
DISPLAY_BACKLIT
  Top 0.254: R18.2 80.82,47.83 C34.1 77.28,47.83 75.46,46.01 J1.4
DISPLAY_CS
  Top 0.254: U2.28 60.8,62 62.85,59.95 62.85,54 68.3,48.55 J1.5
DISPLAY_DATA_CMD
  Top 0.254: U2.26 60.54,59.46 61,59 61,54 65.05,49.95 65.05,45.2 66.78,43.47 J1.3
DISPLAY_RESET
  Top 0.254: R15.2 79.7,42.77 C2.1 76.5,42 75.91,42 74.84,40.93 J1.2
DISPLAY_SD_MISO
  Top 0.254: U2.31 62.59,65.81 66.2,62.2 66.2,57.65 67.7,56.15 73.72,56.15 J1.8
DISPLAY_SD_MOSI
  Top 0.254: U2.37 63.52,73.43 68.1,68.85 73.72,68.85 J1.13
DISPLAY_SD_SCK
  Top 0.254: U2.30 62.01,64.54 65.2,61.35 65.2,56.25 67.65,53.8 73.57,53.8 J1.7
EECLK
  Top 0.178: IC3.62 27.07,24.34 | IC4.4 30.85,18.45 30.85,20.58 27.09,24.34
  Top 0.254: 30.85,18.45 R8.2 | 27.07,24.34 27.09,24.34
EECS
  Top 0.178: IC3.63 27.57,25.48 32.66,20.39 R7.1 30.05,15.55 29.9,15.7 IC4.5
EEDATA
  Top 0.178: IC3.61 26.57,23.73 27.5,22.8 27.5,19.1 26.8,18.4 26.8,8.5 27.4,7.9 28.34,7.9 R10.2
  Top 0.254: R10.2 31.04,9.39 31.4,9.75 31.4,12.9 30.85,13.45 IC4.3
ESP-EN
  Top 0.178: R4.1 5.65,70.49 ESP-RST.P$2 13.32,71.87 13.95,72.5 31.1,72.5 31.6,72 41.14,72
  Top 0.254: 41.14,72 U2.3
ESP-IO0
  Top 0.254: R1.1 63.2,49.08 ESP-PROG.P$1 60.12,53.48 59.45,54.15 59.45,58.04 U2.25
ESP_ATTINY_CON
  Top 0.254: U2.24 56.02,55.52 55,54.5 55,52.66 R19.2
ESP_LED1
  Top 0.254: U2.27 57.93,60.73 57.4,60.2 57.4,52.29 54.72,49.61 R20.2
GND  (via drill 0.8, 1)
  Top 0.178: IC3.10 30.01,35.05 28.85,35.05 29.3,35.5 IC3.11 29.19,35.5 28.9,35.79 28.9,36.45 28.8,36.55 30.01,36.55 IC3.13 26.79,36.5 24.15,39.14 24.15,39.91 IC3.25 | C10.2 32.89,27.5 32.89,29.96 32.35,30.5 IC3.1 28.2,30.5 28,30.7 28,32 28.5,32.5 IC3.5 | C12.2 34.75,37.5 33.5,37.5 33.36,37.64 31.94,37.64 31.8,37.5 IC3.15 | C16.2 16.03,31 IC3.47 19.85,31 21.49,29.36 21.49,28.59 IC3.51 | IC3.35 17,37 15.64,38.36 C17.2
  other vias: 24.2,21.75 24.8,12.3 30.25,12.45 29.75,5.2 80,55
  pour Bottom: 0,76 0,0 102,0 102,76
  pour Top (isolate 0.305): 0,76 0,0 102,0 102,76
GPIO_APA104_DATA
  Top 0.254: IC5.4 55.96,14.29 56.3,13.95 56.27,13.93 IC1.3 56.27,11.18 55.6,10.5 52.5,10.5 52,10 42.08,10 ATTINY13A.1
JTAG_CLK
  Top 0.254: IC3.16 30.06,38.56 32.3,40.8 39.35,40.8 45.85,47.3 U2.16
JTAG_TDI
  Top 0.254: IC3.17 41.3,53.22 U2.14
JTAG_TDO
  Top 0.178: 27.61,39.94 27.61,39.12 | 27.79,38.95 28.4,38.95 42.55,53.1 42.55,57.2 43.9,58.55 54.15,58.55 54.74,57.95 U2.23
  Top 0.254: 27.61,39.12 27.79,38.95 | IC3.18 27.61,39.94
JTAG_TMS
  Top 0.178: IC3.19 27.07,41.22 39.6,53.75 39.6,58.8 40.26,59.46 U2.13
N$1
  Top 0.254: U$4.1 94,64.07 94,61 95.33,59.67 D1.C
N$2
  Top 0.254: OFF/ON.2 77.29,13.13 IC2.5
N$4
  Top 0.254: IC5.2 55.81,23.19 IC6.4
N$5
  Top 0.254: IC-IP5305.LED1 93,27.53 93,31.12 LED1.A 91.8,36.96 LED4.K
N$6
  Top 0.254: IC3.14 32.62,37 R5.2
N$7
  Top 0.178: IC3.6 43,33 44.1,31.9 R6.1
N$8
  Top 0.254: R9.1 27.94,10 29.13,11.19 R10.1 29.83,11.29 28.95,12.17 IC4.1
N$9
  Top 0.254: R20.1 54.72,44.1 LED8.A
N$10
  Top 0.254: IC-IP5305.VOUT 94.11,19.36 C23.2 94.52,16.14 C24.2 94.55,13.65 95.14,13.06 RESETTABLE_FUSE.1
N$11
  Top 0.254: LED2.A 13.87,12.66 R11.1
N$12
  Top 0.254: IC6.2 54.52,27 61.45,27 63.14,28.69 IC7.4
N$13
  Top 0.254: LED3.A 18.77,12.65 R12.1
N$14
  Top 0.254: IC-IP5305.LED2 91.58,28.73 91.2,29.1 88.9,29.1 87,31 87,31.97 LED6.K 86.74,36.98 LED5.A
N$15
  Top 0.254: LED1.K 89.26,36.96 LED4.A 89.24,38.76 88,40 86,40 84.24,38.24 LED5.K 84.2,36.98 LED6.A 84.2,29.8 86.63,27.37 IC-IP5305.LED3
N$16
  Top 0.254: R2.2 97.61,35.15 C22.2
N$17
  Top 0.254: IC-IP5305.SW 92.84,20.3 90.33,17.78 L1.2
N$18
  Top 0.254: IC3.9 38.26,34.5 C19.1 41.33,35.45 C18.1 43.9,35.58 EMIFILTER2.3
N$19
  Top 0.178: IC3.4 34,32 34.69,31.31 C21.1
  Top 0.254: C21.1 36.07,31.28 C20.1 41.18,31.28 EMIFILTER1.3
N$20
  Top 0.254: IC-IP5305.BAT 91.58,20.57 90.45,19.45 88,19.45 87.6,19.05 87.6,15.5 L1.1 87.39,15.29 C25.1 90.8,10.73 J3.1
N$21
  Top 0.254: R3.1 88.72,22.07 IC-IP5305.KEY 90.31,20.95 89.87,20.52 R17.1
N$22
  Top 0.254: IC8.4 66.34,23.48 IC7.2
N$24
  Top 0.254: R3.2 86.9,24.64 LED7.A
N$25
  Top 0.254: R17.2 80.97,20.52 U$5.P$2
OSCI
  Top 0.178: C6.1 38.58,20.58 F1.2 | IC3.2 32.55,31 33.25,30.3 33.25,28.1 34.5,26.85 37.15,26.85 38.1,25.9 38.1,24.4 36.65,22.95
  Top 0.254: 36.65,22.95 F1.2
OSCO
  Top 0.178: C7.1 44.91,22.15 | IC3.3 33.3,31.5 34.05,30.75 34.05,28.45 34.85,27.65 38.95,27.65 43.65,22.95
  Top 0.254: 44.91,22.15 F1.1 43.65,22.95
PAIR_RX
  Top 0.254: J4.2 24.03,65.68 26.7,68.35 U2.6
PAIR_TX
  Top 0.178: J4.1 18.06,59.9 34.1,59.9 37.47,63.27 U2.10
PB0
  Top 0.254: ATTINY13A.6 54.45,5.99 IC1.5
PB1
  Top 0.254: ATTINY13A.5 48.23,5.77 50,4 55,4 56.27,5.28 IC1.6
PB2
  Top 0.254: ATTINY13A.4 48.68,3 56,3 57.55,4.54 IC1.7
PB5
  Top 0.254: R16.1 59.31,11.97 IC1.1 58.81,9.52 57.9,8.6 54.6,8.6 54,8 45.16,8 ATTINY13A.3
PROG_RX
  Top 0.254: U2.34 59.32,69.6 61.75,69.6 68.2,63.15 68.2,62.7 69.17,61.73 R14.1
PROG_TX
  Top 0.254: U2.35 62.01,70.89 67.95,64.95 70.31,64.95 R13.1
PWREN
  Top 0.178: IC3.60 26.07,23.18 26.52,22.73 26.52,20.42 25.9,19.8 25.9,17.23 R22.2
RXD_LED
  Top 0.178: IC3.54 23.07,27.67 21.5,26.1 21.5,21.8 18.8,19.1 14.95,19.1 13.87,18.02 LED2.K
RXD_SPI_PROM_MOSI
  Top 0.178: J2.3 8.44,37.96 11.4,35 IC3.39
  Top 0.254: R13.2 73.17,63.22 J1.11
  Bottom 0.254: J2.3 4.29,37.96 2,40.25 2,48 5,51 44,51 56.79,63.79 J1.11
SCL
  Top 0.254: U2.36 62.49,72.16 68.4,66.25 73.66,66.25 J1.12 75.53,66.33 77.05,67.85 82.05,67.85 82.95,66.95 82.95,65.95 81.98,64.98 U$1.SCL
  Bottom 0.254: J1.12 78.33,66.33 80.03,68.03 94.34,68.03 94.37,68 95.15,68 U$4.5
SD_CS
  Top 0.254: U2.29 59.32,63.25 61.3,63.25 64.15,60.4 64.15,55.05 68.11,51.09 J1.6
SDA
  Top 0.254: U2.33 61.6,68.35 67.15,62.8 67.15,59.55 68.05,58.65 68.11,58.71 J1.9 74.03,59 76,59 77,60 77,64 79.25,66.25 U$1.SDA
  Bottom 0.254: J1.9 81.82,66.79 U$4.2
SPI_PROM_CS
  Top 0.178: J2.1 8.28,32.88 9.4,34 IC3.41
SPI_PROM_MISO
  Top 0.178: J2.2 9.63,35.42 10.55,34.5 IC3.40
SVN
  Top 0.254: J4.3 22.57,68.22 23.85,69.5 41.18,69.5 U2.5
SVP
  Top 0.254: J4.4 41.17,70.76 U2.4
TOUCH_CLK
  Top 0.254: J8.2 33.07,56.07 39,62 U2.11
TOUCH_CS
  Top 0.254: J8.1 32.53,53.53 39.73,60.73 U2.12
TOUCH_DATA_IN
  Top 0.254: J8.6 32.48,66.23 32.5,66.25 33.65,66.25 34.48,67.08 U2.7
TOUCH_DATA_OUT
  Top 0.254: J8.4 32.75,61.15 36,64.4 41.16,64.4 U2.9
TOUCH_IRQ
  Top 0.254: J8.5 33.09,63.69 35.21,65.81 U2.8
TXD_LED
  Top 0.178: LED3.K 22.2,20.68 22.2,25.9 23.57,27.27 IC3.55
TXD_SPI_PROM_CLK
  Top 0.178: IC3.38 12.5,35.5 8.65,39.35 5.89,39.35 J2.4
  Top 0.254: R14.2 72.42,59.93 J1.10
  Bottom 0.254: J2.4 12.89,48.65 45.4,48.65 58,61.25 J1.10
USB_DM
  Top 0.178: IC3.7 49.15,33.5
  Top 0.254: 49.15,33.5 49.3,33.5 78.15,33.5 86.39,41.74 U$2.D-
USB_DP
  Top 0.178: 77.49,34 IC3.8
  Top 0.254: U$2.D+ 97.14,42.42 85.91,42.42 77.49,34
VBAT  (via drill 1)
  Top 0.254: RESETTABLE_FUSE.2 95,9.81 95,7 93,5 81.42,5 OFF/ON.3 76.38,4.65 C4.1 76.32,7.53 IC2.4 | IC1.8 59.19,6.17 C32.1 C33.1 64.59,5 v66,5 | R16.2 62.83,10.25 64.6,10.25 66,8.85 v66,5 | 67,9.75 64.8,11.95 62.9,11.95 60.61,14.24 C26.1 63.07,15.41 IC8.1 | 67,9.75 67,12.85 68.5,14.35 68.5,18 | 68.5,18 68.5,25.7 | 68.5,25.7 68.5,29.7 67.2,31 59.8,31 58.68,29.88 C28.1 58.61,28.91 IC6.1 | 68.5,25.7 61.7,25.7 60.35,24.35 C29.1 60.54,24.12 IC7.1 | IC5.1 56.06,20.04 C27.1 58.71,18.79 59.5,18 68.5,18 | v66,5 66.95,5.95 67,5.95 67,9.75
  Bottom 0.254: OFF/ON.3 66.35,4.65 v66,5
VCC  (via drill 0.8, 1)
  Top 0.254: IC2.1 70.22,7.71 C5.1 | J1.1 76.35,41 80.65,41 81.75,42.1 81.75,44.25 81.61,44.39 R15.1 | J1.1 75.04,38.39 76.7,40.05 81.05,40.05 82.65,41.65 82.65,48.85 81.93,49.57 R18.1 | C5.1 69,7.6 68.1,6.7 68.1,2.9 66.85,1.65 33,1.65 | 13.6,5.6 17.55,1.65 19,1.65 | 13.6,5.6 5.62,13.57 | 5.62,13.57 1.95,17.25 1.95,30 | 1.95,30 1.95,44.05 3.48,45.58 J2.6 | 33,1.65 26,1.65 | 26,1.65 22.8,1.65 | 22.8,1.65 19,1.65 | v70,10 70.11,9.89 C5.1 | IC3.20 26.57,43.47 C15.1 25.4,43.6 v24,45 | IC3.31 21.07,43.25 | 21.07,43.25 C14.1 | IC3.42 16.83,33.5 C16.1 10.58,32.58 8,30 1.95,30 | IC3.50 21.07,27.22 20.45,26.6 20.45,25.1 19.29,23.94 C8.1 19.04,21.24 17.8,20 12.05,20 5.62,13.57 | IC3.56 24.07,26.02 C11.1 23.37,25.73 23.35,25.75 22.8,25.2 22.8,1.65 | IC4.6 28.95,18.45 R8.1 28.45,18.5 28,18.05 28,15.7 28.64,15.06 31.28,15.06 31.29,15.05 31.6,15.05 33.36,13.29 C3.1 35.34,12.34 35.65,12.65 | R9.2 26,9.91 26,1.65 | 33,1.65 33,7.35 35.65,10 35.65,12.65 | 35.65,12.65 35.65,13 | 35.65,13 35.65,14.95 35.05,15.55 R7.2 | R12.2 18.73,1.92 19,1.65 | R11.2 13.93,5.93 13.6,5.6 | v24,45 22.25,43.25 21.07,43.25 | v24,45 24,46 23.05,46.95 6.11,46.95 J2.6 | U2.2 41.24,73.37 C1.1 36.25,74.15 35.5,74.9 3,74.9 | J2.6 1.5,48.82 1.5,73.55 2.85,74.9 3,74.9 | R4.2 3.15,74.75 3,74.9 | J1.1 67.41,38.39 67.4,38.4 | 67.4,38.4 63.3,42.5 63.3,44.53 R1.2 | J1.1 75.68,36.45 78.25,36.45 84.1,42.3 84.1,55 | 84.1,55 84.1,59.12 C35.1 80.93,62.29 U$1.VCC | D1.A 84.47,55.37 84.1,55 | 35.65,13 43,13 50,20 50,25 47,28 42.44,28 EMIFILTER1.1 | 67.4,38.4 66.49,37.49 49.95,37.49 | 49.95,37.49 EMIFILTER2.1 | R5.1 33.38,39.5 47.94,39.5 49.95,37.49
  Bottom 0.254: v70,10 73.74,13.74 J1.1
VCC1.8  (via drill 0.8)
  Top 0.254: IC3.12 34.83,36 C12.1 34.98,35.85 v37,35.85 | IC3.37 14.92,36 C17.1 14.17,36.75 12.75,36.75 12,37.5 v12,38 | IC3.64 30.07,26.51 C10.1 30.35,26.66 30.35,28.2 31.45,29.3 v31.85,29.3 | IC3.49 20.57,28.24 C9.1 18.77,27.28 18.1,27.95 v15.15,27.95
  Bottom 0.254: v15.15,27.95 12,31.1 v12,38 34.85,38 v37,35.85 31.85,30.7 v31.85,29.3
VCC5V
  Top 0.254: U$2.+5V 96.09,41.09 95.76,40.76 R2.1 95.76,34.31 95.5,34.05 95.5,31.87 | 95.5,31.87 C13.2 | IC-IP5305.VIN 94.11,31.41 94.57,31.87 95.5,31.87